# EAGLE design RNS (EAGLE 9.6.2)
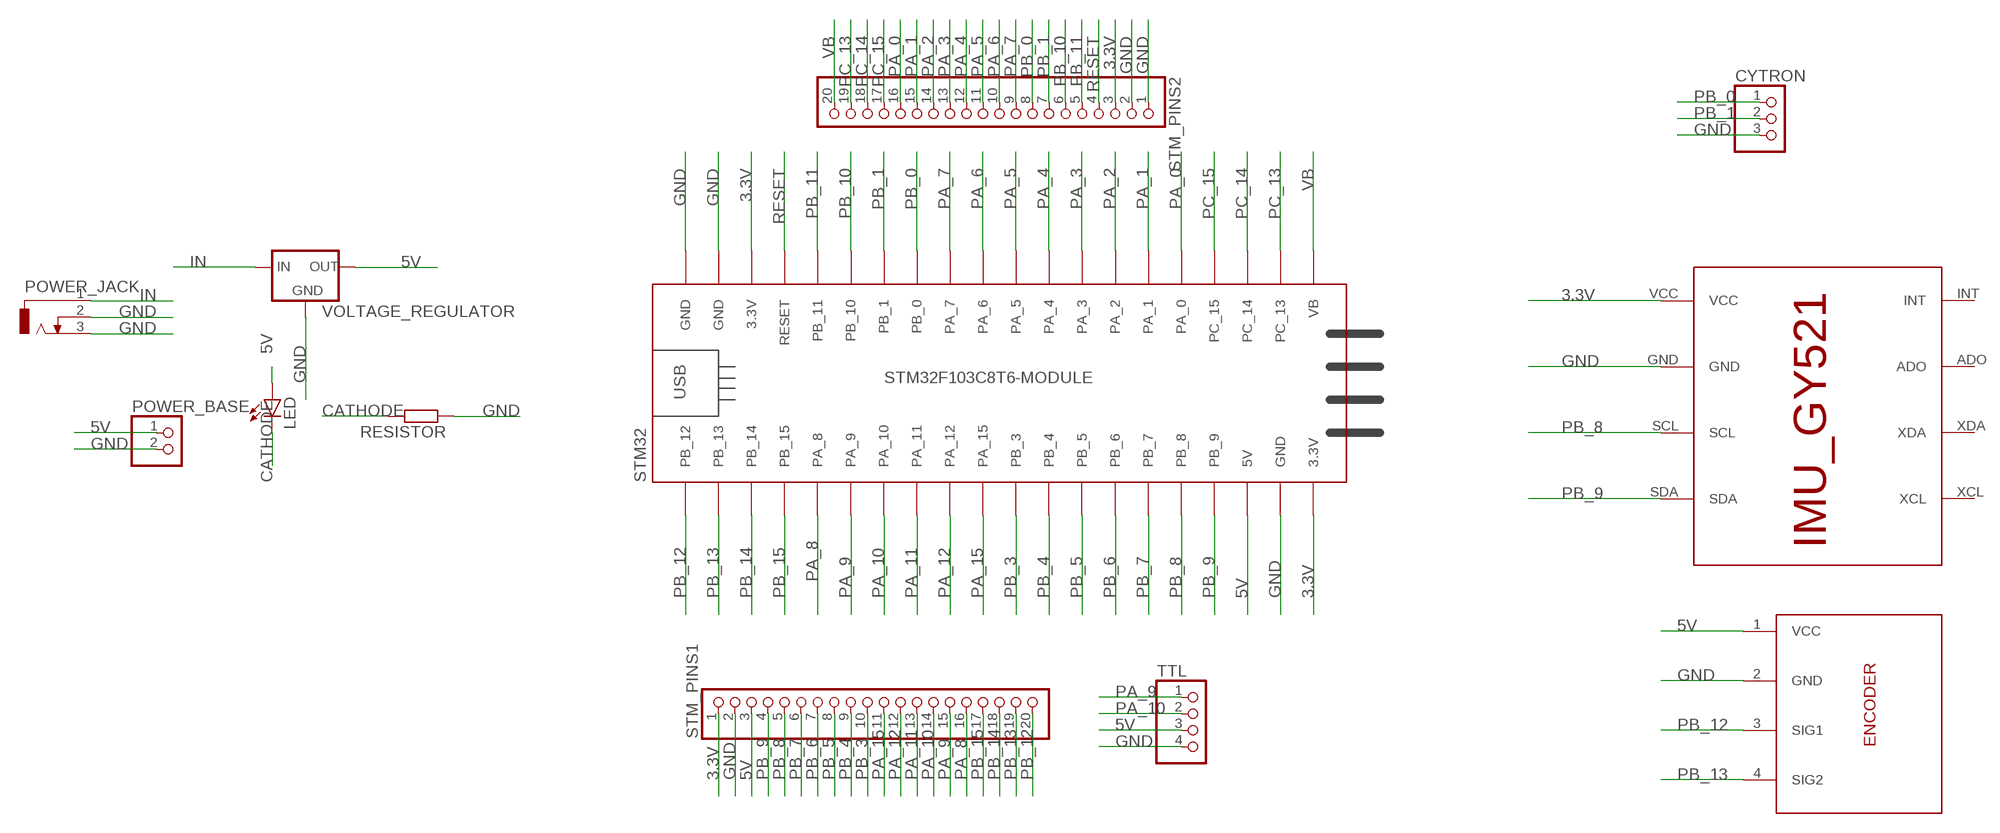
[diagram p0: schematic, sheet 1]

## Parts
CYTRON  PINHD-3_DATA  [1X03_DATA]
ENCODER  ENCODER  [1X04_DATA]
IMU  IMU_ROBOCON_GY521  [IMU_GY521]
LED  LED5MM  [LED5MM]
POWER_BASE  PINHD-2_DATA  [1X02_DATA]
POWER_JACK  CON_JACK  [DCJ0303]
RESISTOR  R-EU_0207/12  [0207/12]
STM32  STM32F103C8T6-MODULE  [STM32F103C8T6-MODULE]
STM_PINS1  PINHD-1X20  [1X20]
STM_PINS2  PINHD-1X20  [1X20]
TTL  PINHD-1X4  [1X04]
VOLTAGE_REGULATOR  78XXS  [78XXS]

## Nets
3.3V: IMU.VCC STM32.3.3V_1(3.3V) STM32.3.3V_2(3.3V) STM_PINS1.1 STM_PINS2.3
5V: ENCODER.1(VCC) LED.A POWER_BASE.1 STM32.5V STM_PINS1.3 TTL.3 VOLTAGE_REGULATOR.OUT
CATHODE: LED.K(C) RESISTOR.2
GND: CYTRON.3 ENCODER.2(GND) IMU.GND POWER_BASE.2 POWER_JACK.2 POWER_JACK.3 RESISTOR.1 STM32.GND_1(GND) STM32.GND_2(GND) STM32.GND_3(GND) STM_PINS1.2 STM_PINS2.1 STM_PINS2.2 TTL.4 VOLTAGE_REGULATOR.GND
IN: POWER_JACK.1 VOLTAGE_REGULATOR.IN
PA_0: STM32.PA_0 STM_PINS2.16
PA_1: STM32.PA_1 STM_PINS2.15
PA_2: STM32.PA_2 STM_PINS2.14
PA_3: STM32.PA_3 STM_PINS2.13
PA_4: STM32.PA_4 STM_PINS2.12
PA_5: STM32.PA_5 STM_PINS2.11
PA_6: STM32.PA_6 STM_PINS2.10
PA_7: STM32.PA_7 STM_PINS2.9
PA_8: STM32.PA_8 STM_PINS1.16
PA_9: STM32.PA_9 STM_PINS1.15 TTL.1
PA_10: STM32.PA_10 STM_PINS1.14 TTL.2
PA_11: STM32.PA_11 STM_PINS1.13
PA_12: STM32.PA_12 STM_PINS1.12
PA_15: STM32.PA_15 STM_PINS1.11
PB_0: CYTRON.1 STM32.PB_0 STM_PINS2.8
PB_1: CYTRON.2 STM32.PB_1 STM_PINS2.7
PB_3: STM32.PB_3 STM_PINS1.10
PB_4: STM32.PB_4 STM_PINS1.9
PB_5: STM32.PB_5 STM_PINS1.8
PB_6: STM32.PB_6 STM_PINS1.7
PB_7: STM32.PB_7 STM_PINS1.6
PB_8: IMU.SCL STM32.PB_8 STM_PINS1.5
PB_9: IMU.SDA STM32.PB_9 STM_PINS1.4
PB_10: STM32.PB_10 STM_PINS2.6
PB_11: STM32.PB_11 STM_PINS2.5
PB_12: ENCODER.3(SIG1) STM32.PB_12 STM_PINS1.20
PB_13: ENCODER.4(SIG2) STM32.PB_13 STM_PINS1.19
PB_14: STM32.PB_14 STM_PINS1.18
PB_15: STM32.PB_15 STM_PINS1.17
PC_13: STM32.PC_13 STM_PINS2.19
PC_14: STM32.PC_14 STM_PINS2.18
PC_15: STM32.PC_15 STM_PINS2.17
RESET: STM32.RESET STM_PINS2.4
VB: STM32.VB STM_PINS2.20
Unconnected: IMU.ADO IMU.INT IMU.XCL IMU.XDA

## Library data of the parts
CYTRON = MIA_LIBRARY-2-2-2:PINHD-3_DATA: PIN HEADER
ENCODER = MIA_LIBRARY-2-2-2:ENCODER
IMU = MIA_LIBRARY-2-2-2:IMU_ROBOCON_GY521
LED = led:LED: LED OSRAM: - CHIPLED LG R971, LG N971, LY N971, LG Q971, LY Q971, LO R971, LY R971 LH N974, LH R974 LS Q976, LO Q976, LY Q976 LO Q996 - Hyper CHIPLED LW Q18S LB Q993, LB Q99A, LB R99A - SideLED LS A670, LO A670, LY A670, LG A670, LP A670 LB A673, LV A673, LT A673, LW A673 LH A674 LY A675 LS A676, LA A676, LO A676, LY A676, LW A676 LS A679, LY A679, LG A679 - Hyper Micro SIDELED® LS Y876, LA Y876, LO Y876, LY Y876 LT Y87S - SmartLED LW L88C, LW L88S LB L89C, LB L89S, LG L890 LS L89K, LO L89K, LY L89K LS L896, LA L896, LO L896, LY L896 - TOPLED LS T670, LO T670, LY T670, LG T670, LP T670 LSG T670, LSP T670, LSY T670, LOP T670, LYG T670 LG T671, LOG T671, LSG T671 LB T673, LV T673, LT T673, LW T673 LH T674 LS T676, LA T676, LO T676, LY T676, LB T676, LH T676, LSB T676, LW T676 LB T67C, LV T67C, LT T67C, LS T67K, LO T67K, LY T67K, LW E67C LS E67B, LA E67B, LO E67B, LY E67B, LB E67C, LV E67C, LT E67C LW T67C LS T679, LY T679, LG T679 LS T770, LO T770, LY T770, LG T770, LP T770 LB T773, LV T773, LT T773, LW T773 LH T774 LS E675, LA E675, LY E675, LS T675 LS T776, LA T776, LO T776, LY T776, LB T776 LHGB T686 LT T68C, LB T68C - Hyper Mini TOPLED® LB M676 - Mini TOPLED Santana® LG M470 LS M47K, LO M47K, LY M47K Source: http://www.osram.convergy.de LUXEON: - LUMILED® LXK2-PW12-R00, LXK2-PW12-S00, LXK2-PW14-U00, LXK2-PW14-V00 LXK2-PM12-R00, LXK2-PM12-S00, LXK2-PM14-U00 LXK2-PE12-Q00, LXK2-PE12-R00, LXK2-PE12-S00, LXK2-PE14-T00, LXK2-PE14-U00 LXK2-PB12-K00, LXK2-PB12-L00, LXK2-PB12-M00, LXK2-PB14-N00, LXK2-PB14-P00, LXK2-PB14-Q00 LXK2-PR12-L00, LXK2-PR12-M00, LXK2-PR14-Q00, LXK2-PR14-R00 LXK2-PD12-Q00, LXK2-PD12-R00, LXK2-PD12-S00 LXK2-PH12-R00, LXK2-PH12-S00 LXK2-PL12-P00, LXK2-PL12-Q00, LXK2-PL12-R00 Source: www.luxeon.com KINGBRIGHT: KA-3528ASYC Source: www.kingbright.com
POWER_BASE = MIA_LIBRARY-2-2-2:PINHD-2_DATA: PIN HEADER
POWER_JACK = MIA_LIBRARY-2-2-2:CON_JACK: DC POWER JACK Source: DCJ0303.pdf; OC_FARNELL: unknown; OC_NEWARK: unknown
RESISTOR = rcl:R-EU_: RESISTOR, European symbol; SPICEPREFIX: R
STM32 = MIA_LIBRARY-2-2-2:STM32F103C8T6-MODULE: STM32F103C8T6 module with ARM Cortex-3, 20kB SRAM, 64kB Flash, 72MHz
STM_PINS1 STM_PINS2 = MIA_LIBRARY-2-2-2:PINHD-1X20: PIN HEADER
TTL = MIA_LIBRARY-2-2-2:PINHD-1X4: PIN HEADER
VOLTAGE_REGULATOR = MIA_LIBRARY-2-2-2:78XXS: VOLTAGE REGULATOR

## Board
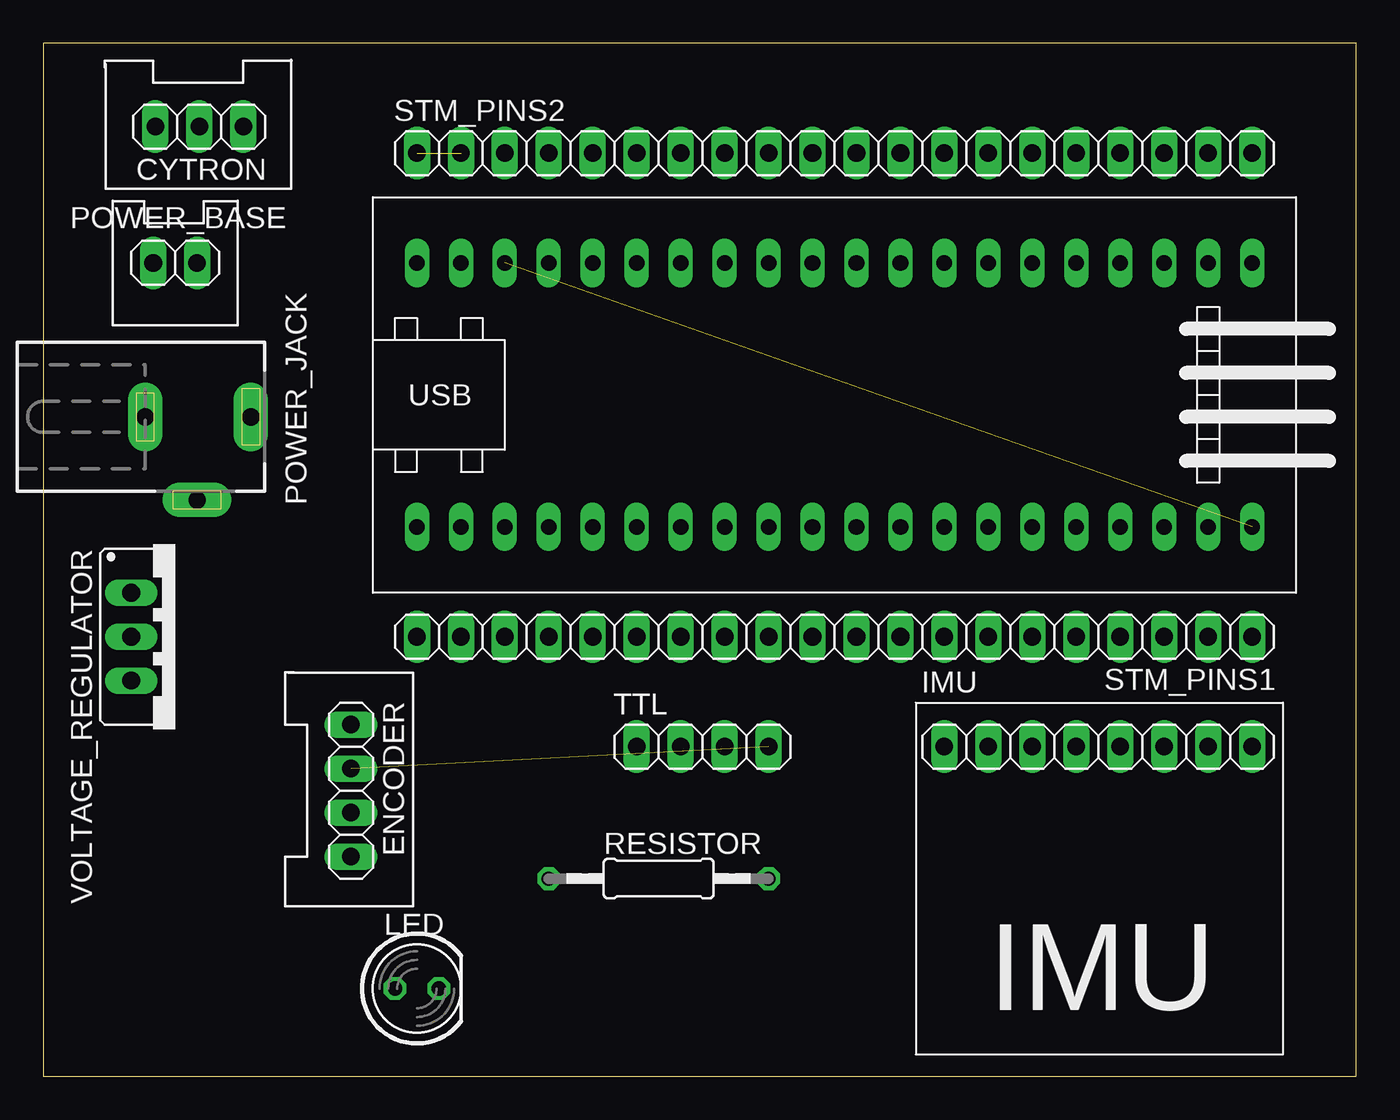
[diagram p1: board, top side]
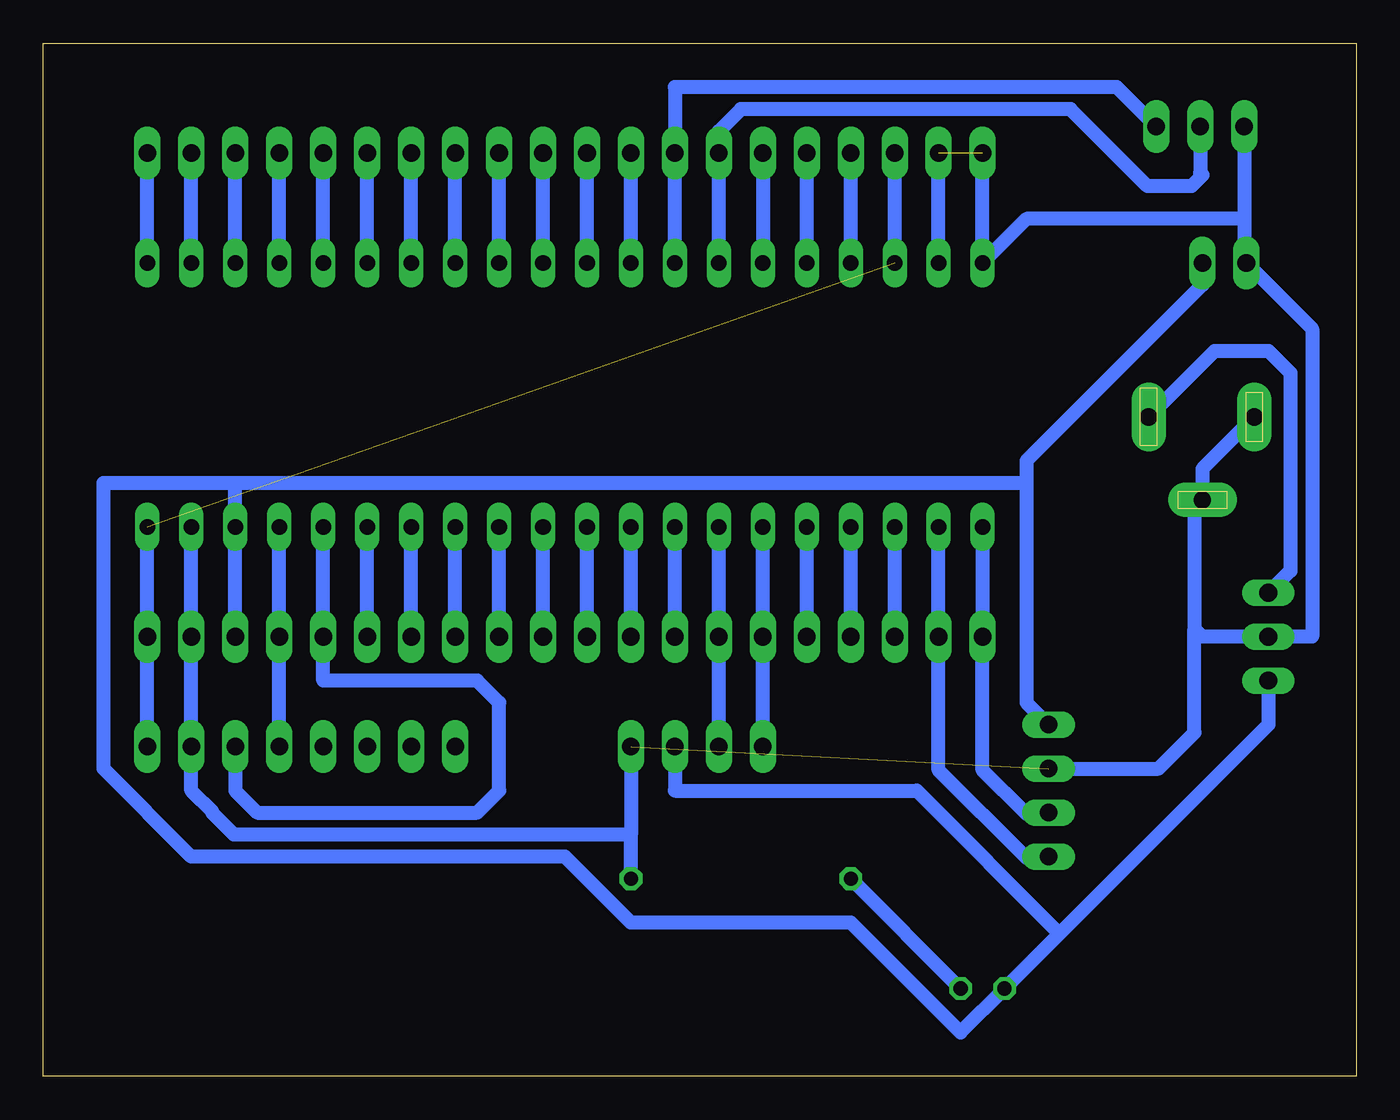
[diagram p2: board, bottom side, seen from below]

Size 75.87 x 59.68 mm. Coordinates in mm from the lower left corner, seen from the top.
Outline: 0,0 75.87,0 75.87,59.68 0,59.68 0,0
Copper layers (1*16): Top 0.035mm / dielectric 1.5mm / Bottom 0.035mm
Design rules "default": minimum track width 6mil, minimum drill 0.35mm, track to track 6mil, track to pad 6mil, pad to pad 6mil, via to via 6mil, smd to smd 6mil, copper to edge 40mil, drill to drill 6mil, minimum pad ring 10mil, minimum via ring 8mil, stop-mask expansion 4mil, vias tented up to drill 0mil, thermal gap 10mil

### Footprints (pad centres in the part's own frame; a part is rotated, then mirrored left to right if it is on the bottom)
1X03_DATA = drill 1.016 long: 1 -2.54,0; 2 0,0; 3 2.54,0
1X04_DATA = drill 1.016 long: 1 -3.81,0; 2 -1.27,0; 3 1.27,0; 4 3.81,0
IMU_GY521 = drill 1.016 long: ADO -6.35,0; GND 6.35,0; INT -8.89,0; SCL 3.81,0; SDA 1.27,0; VCC 8.89,0; XCL -3.81,0; XDA -1.27,0
LED5MM = drill 0.813 octagon: A -1.27,0; K 1.27,0
1X02_DATA = drill 1.016 long: 1 -1.27,0; 2 1.27,0
DCJ0303 = drill 1 pad 2 long: 1 0,3.1; 2 4.8,0; 3 0,-3
0207/12 = drill 0.813 octagon: 1 -6.35,0; 2 6.35,0
STM32F103C8T6-MODULE = drill 0.9 long: 3.3V_1 25.4,-7.62; 3.3V_2 -17.78,7.62; 5V 20.32,-7.62; GND_1 22.86,-7.62; GND_2 -20.32,7.62; GND_3 -22.86,7.62; PA_0 15.24,7.62; PA_1 12.7,7.62; PA_2 10.16,7.62; PA_3 7.62,7.62; PA_4 5.08,7.62; PA_5 2.54,7.62; PA_6 0,7.62; PA_7 -2.54,7.62; PA_8 -12.7,-7.62; PA_9 -10.16,-7.62; PA_10 -7.62,-7.62; PA_11 -5.08,-7.62; PA_12 -2.54,-7.62; PA_15 0,-7.62; PB_0 -5.08,7.62; PB_1 -7.62,7.62; PB_3 2.54,-7.62; PB_4 5.08,-7.62; PB_5 7.62,-7.62; PB_6 10.16,-7.62; PB_7 12.7,-7.62; PB_8 15.24,-7.62; PB_9 17.78,-7.62; PB_10 -10.16,7.62; PB_11 -12.7,7.62; PB_12 -22.86,-7.62; PB_13 -20.32,-7.62; PB_14 -17.78,-7.62; PB_15 -15.24,-7.62; PC_13 22.86,7.62; PC_14 20.32,7.62; PC_15 17.78,7.62; RESET -15.24,7.62; VB 25.4,7.62
1X20 = drill 1.016 long: 1 -24.13,0; 2 -21.59,0; 3 -19.05,0; 4 -16.51,0; 5 -13.97,0; 6 -11.43,0; 7 -8.89,0; 8 -6.35,0; 9 -3.81,0; 10 -1.27,0; 11 1.27,0; 12 3.81,0; 13 6.35,0; 14 8.89,0; 15 11.43,0; 16 13.97,0; 17 16.51,0; 18 19.05,0; 19 21.59,0; 20 24.13,0
1X04 = drill 1.016 long: 1 -3.81,0; 2 -1.27,0; 3 1.27,0; 4 3.81,0
78XXS = drill 1.016 long: GND 0,-2.54; IN -2.54,-2.54; OUT 2.54,-2.54

### Placement (x,y rotation side)
CYTRON  9.02,54.86 180 top
ENCODER  17.78,16.51 270 top
IMU  60.96,19.05 0 top
LED  21.59,5.08 0 top
POWER_BASE  7.62,46.99 180 top
POWER_JACK  8.89,38.1 270 top
RESISTOR  35.56,11.43 180 top
STM32  44.45,39.37 0 top
STM_PINS1  45.72,25.4 180 top
STM_PINS2  45.72,53.34 0 top
TTL  38.1,19.05 0 top
VOLTAGE_REGULATOR  7.62,25.4 270 top

### Tracks (layer width: path | path; a pad name or v marks a point on that pad's centre or on a via)
3.3V  (1 unrouted)
  Bottom 0.8: STM32.3.3V_2 STM_PINS2.3 | STM32.3.3V_1 STM_PINS1.1 IMU.VCC
5V
  Bottom 0.8: STM_PINS1.3 STM32.5V 64.77,34.29 | POWER_BASE.1 8.89,45.72 19.05,35.56 19.05,34.29 | 19.05,34.29 19.05,21.59 ENCODER.1 | 17.14,8.26 5.08,20.32 VOLTAGE_REGULATOR.OUT | 64.77,34.29 19.05,34.29 | TTL.3 39.37,16.51 25.4,16.51 17.14,8.26 | 17.14,8.26 LED.A 22.86,2.54 29.21,8.89 41.91,8.89 45.72,12.7 67.31,12.7 72.39,17.78 72.39,34.29 64.77,34.29
CATHODE
  Bottom 0.8: LED.K RESISTOR.2
GND  (2 unrouted)
  Bottom 0.8: STM32.GND_2 STM_PINS2.2 | STM_PINS2.1 STM32.GND_3 19.05,49.53 6.48,49.53 | STM32.GND_1 STM_PINS1.2 IMU.GND 67.31,16.51 66.08,15.28 66.08,15.2 64.85,13.97 41.91,13.97 | 9.35,25.86 8.89,25.4 VOLTAGE_REGULATOR.GND 2.54,25.4 2.54,43.18 POWER_BASE.2 6.48,46.99 6.48,49.53 | ENCODER.2 11.43,17.78 9.35,19.86 9.35,25.86 | CYTRON.3 6.48,49.53 | POWER_JACK.3 8.89,35.1 POWER_JACK.2 9.35,32.84 9.35,25.86 | TTL.4 41.91,13.97 | RESISTOR.1 41.91,13.97
IN
  Bottom 0.8: POWER_JACK.1 8.18,41.91 5.08,41.91 3.81,40.64 3.81,29.21 VOLTAGE_REGULATOR.IN
PA_0
  Bottom 0.8: STM32.PA_0 STM_PINS2.16
PA_1
  Bottom 0.8: STM32.PA_1 STM_PINS2.15
PA_2
  Bottom 0.8: STM32.PA_2 STM_PINS2.14
PA_3
  Bottom 0.8: STM32.PA_3 STM_PINS2.13
PA_4
  Bottom 0.8: STM32.PA_4 STM_PINS2.12
PA_5
  Bottom 0.8: STM32.PA_5 STM_PINS2.11
PA_6
  Bottom 0.8: STM32.PA_6 STM_PINS2.10
PA_7
  Bottom 0.8: STM32.PA_7 STM_PINS2.9
PA_8
  Bottom 0.8: STM_PINS1.16 STM32.PA_8
PA_9
  Bottom 0.8: STM32.PA_9 STM_PINS1.15 TTL.1
PA_10
  Bottom 0.8: STM32.PA_10 STM_PINS1.14 TTL.2
PA_11
  Bottom 0.8: STM_PINS1.13 STM32.PA_11
PA_12
  Bottom 0.8: STM_PINS1.12 STM32.PA_12
PA_15
  Bottom 0.8: STM_PINS1.11 STM32.PA_15
PB_0
  Bottom 0.8: STM32.PB_0 STM_PINS2.8 39.37,57.15 13.84,57.15 CYTRON.1
PB_1
  Bottom 0.8: STM32.PB_1 STM_PINS2.7 36.83,54.61 35.56,55.88 16.51,55.88 12.06,51.44 9.53,51.44 8.89,52.07 9.02,52.2 CYTRON.2
PB_3
  Bottom 0.8: STM_PINS1.10 STM32.PB_3
PB_4
  Bottom 0.8: STM_PINS1.9 STM32.PB_4
PB_5
  Bottom 0.8: STM_PINS1.8 STM32.PB_5
PB_6
  Bottom 0.8: STM_PINS1.7 STM32.PB_6
PB_7
  Bottom 0.8: STM_PINS1.6 STM32.PB_7
PB_8
  Bottom 0.8: STM32.PB_8 STM_PINS1.5 59.69,22.86 50.8,22.86 49.53,21.59 49.53,16.51 50.8,15.24 63.5,15.24 64.77,16.51 IMU.SCL
PB_9
  Bottom 0.8: STM32.PB_9 STM_PINS1.4 IMU.SDA
PB_10
  Bottom 0.8: STM_PINS2.6 STM32.PB_10
PB_11
  Bottom 0.8: STM32.PB_11 STM_PINS2.5
PB_12
  Bottom 0.8: STM32.PB_12 STM_PINS1.20 21.59,17.7 19.09,15.2 17.82,15.2 ENCODER.3
PB_13
  Bottom 0.8: STM32.PB_13 STM_PINS1.19 24.13,17.7 19.09,12.66 17.82,12.66 ENCODER.4
PB_14
  Bottom 0.8: STM_PINS1.18 STM32.PB_14
PB_15
  Bottom 0.8: STM_PINS1.17 STM32.PB_15
PC_13
  Bottom 0.8: STM32.PC_13 STM_PINS2.19
PC_14
  Bottom 0.8: STM32.PC_14 STM_PINS2.18
PC_15
  Bottom 0.8: STM32.PC_15 STM_PINS2.17
RESET
  Bottom 0.8: STM32.RESET STM_PINS2.4
VB
  Bottom 0.8: STM32.VB STM_PINS2.20